# Altium schematic sheet FINGER_CONNECTORS.SchDoc
size Letter; SheetNumber: 1; SheetTotal: 15
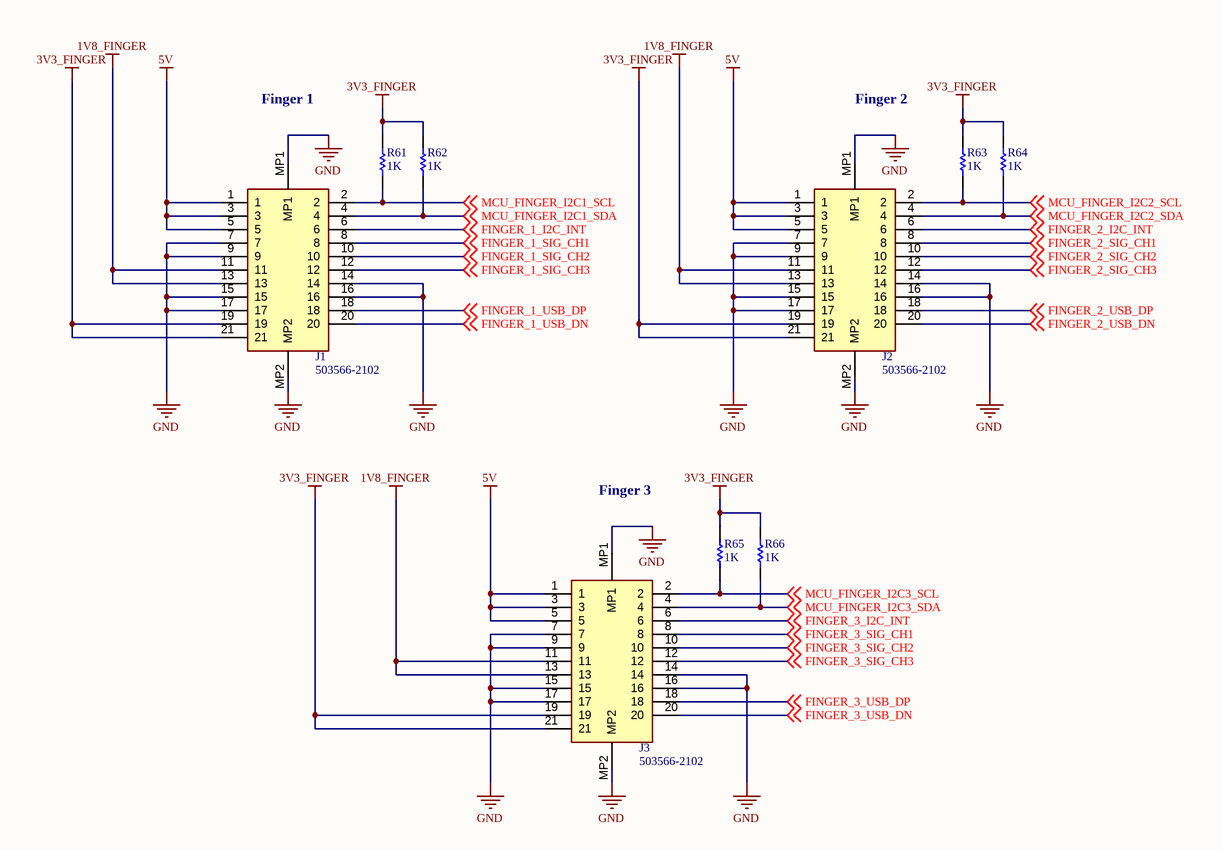
[diagram p0: FINGER_CONNECTORS.SchDoc]

## Parts
J1  503566-2102  [5035662102]
J2  503566-2102  [5035662102]
J3  503566-2102  [5035662102]
R61  1K  [RESC1005X40X25LL05T10]
R62  1K  [RESC1005X40X25LL05T10]
R63  1K  [RESC1005X40X25LL05T10]
R64  1K  [RESC1005X40X25LL05T10]
R65  1K  [RESC1005X40X25LL05T10]
R66  1K  [RESC1005X40X25LL05T10]

## Nets
1V8_FINGER: J1.11 J1.13 J2.11 J2.13 J3.11 J3.13
3V3_FINGER: J1.19 J1.21 J2.19 J2.21 J3.19 J3.21 R61.2 R62.2 R63.2 R64.2 R65.2 R66.2
5V: J1.1 J1.3 J1.5 J2.1 J2.3 J2.5 J3.1 J3.3 J3.5
GND: J1.7 J1.9 J1.14 J1.15 J1.16 J1.17 J1.MP1 J1.MP2 J2.7 J2.9 J2.14 J2.15 J2.16 J2.17 J2.MP1 J2.MP2 J3.7 J3.9 J3.14 J3.15 J3.16 J3.17 J3.MP1 J3.MP2
FINGER_1_I2C_INT: J1.6 ; off-sheet FINGER_1_I2C_INT
FINGER_1_SIG_CH1: J1.8 ; off-sheet FINGER_1_SIG_CH1
FINGER_1_SIG_CH2: J1.10 ; off-sheet FINGER_1_SIG_CH2
FINGER_1_SIG_CH3: J1.12 ; off-sheet FINGER_1_SIG_CH3
FINGER_1_USB_DN: J1.20 ; off-sheet FINGER_1_USB_DN
FINGER_1_USB_DP: J1.18 ; off-sheet FINGER_1_USB_DP
FINGER_2_I2C_INT: J2.6 ; off-sheet FINGER_2_I2C_INT
FINGER_2_SIG_CH1: J2.8 ; off-sheet FINGER_2_SIG_CH1
FINGER_2_SIG_CH2: J2.10 ; off-sheet FINGER_2_SIG_CH2
FINGER_2_SIG_CH3: J2.12 ; off-sheet FINGER_2_SIG_CH3
FINGER_2_USB_DN: J2.20 ; off-sheet FINGER_2_USB_DN
FINGER_2_USB_DP: J2.18 ; off-sheet FINGER_2_USB_DP
FINGER_3_I2C_INT: J3.6 ; off-sheet FINGER_3_I2C_INT
FINGER_3_SIG_CH1: J3.8 ; off-sheet FINGER_3_SIG_CH1
FINGER_3_SIG_CH2: J3.10 ; off-sheet FINGER_3_SIG_CH2
FINGER_3_SIG_CH3: J3.12 ; off-sheet FINGER_3_SIG_CH3
FINGER_3_USB_DN: J3.20 ; off-sheet FINGER_3_USB_DN
FINGER_3_USB_DP: J3.18 ; off-sheet FINGER_3_USB_DP
MCU_FINGER_I2C1_SCL: J1.2 R61.1 ; off-sheet MCU_FINGER_I2C1_SCL
MCU_FINGER_I2C1_SDA: J1.4 R62.1 ; off-sheet MCU_FINGER_I2C1_SDA
MCU_FINGER_I2C2_SCL: J2.2 R63.1 ; off-sheet MCU_FINGER_I2C2_SCL
MCU_FINGER_I2C2_SDA: J2.4 R64.1 ; off-sheet MCU_FINGER_I2C2_SDA
MCU_FINGER_I2C3_SCL: J3.2 R65.1 ; off-sheet MCU_FINGER_I2C3_SCL
MCU_FINGER_I2C3_SDA: J3.4 R66.1 ; off-sheet MCU_FINGER_I2C3_SDA

## Notes on the sheet
- Finger 1
- Finger 2
- Finger 3
- Title
- Copyright (c) Meta Platforms, Inc. and affiliates.
  All rights reserved.
  This source code is licensed under the license found in the
  LICENSE file in the root directory of this source tree.
- Sheet
- of

## Library data of the parts
J1-J3 = 503566-2102: Connector; Manufacturer_Name: Molex; Datasheet Link: https://www.molex.com/pdm_docs/sd/5035662102_sd.pdf; Height: 1.69mm; Manufacturer_Part_Number: 503566-2102; Mouser Part Number: 538-503566-2102; Mouser Price/Stock: https://www.mouser.co.uk/ProductDetail/Molex/503566-2102?qs=0lSvoLzn4L8%252Bw2FHrppS3g%3D%3D
R61-R66 = CMP-2002-07941-1: Part Number: RC0402JR-071KL; Manufacturer: Yageo / Phycomp